# Altium schematic sheet Analog_IOs.SCHDOC: Apalis Evaluation Board 1.1
size A3; Organization: Toradex AG; Address1: Altsagenstrasse 5; Address2: Horw; Address3: 6048; Address4: Switzerland; DocumentNumber: 15; Revision: V1.1; SheetNumber: 15; SheetTotal: 32; PageSetup: Record=PageOptions|CenterHorizontal=True|CenterVertical=True|PrintScale=0.73|XCorrection=1.00|YCorrection=1.00|PrintKind=0|BorderSize=5000000|LeftOffset=0|BottomOffset=0|Orientation=2|PaperLength=1000|PaperWidth=1000|Scale=100|PaperSource=7|PrintQuality=-4|MediaType=1|DitherType=10|PaperKind=A4|PrintScaleMode=1
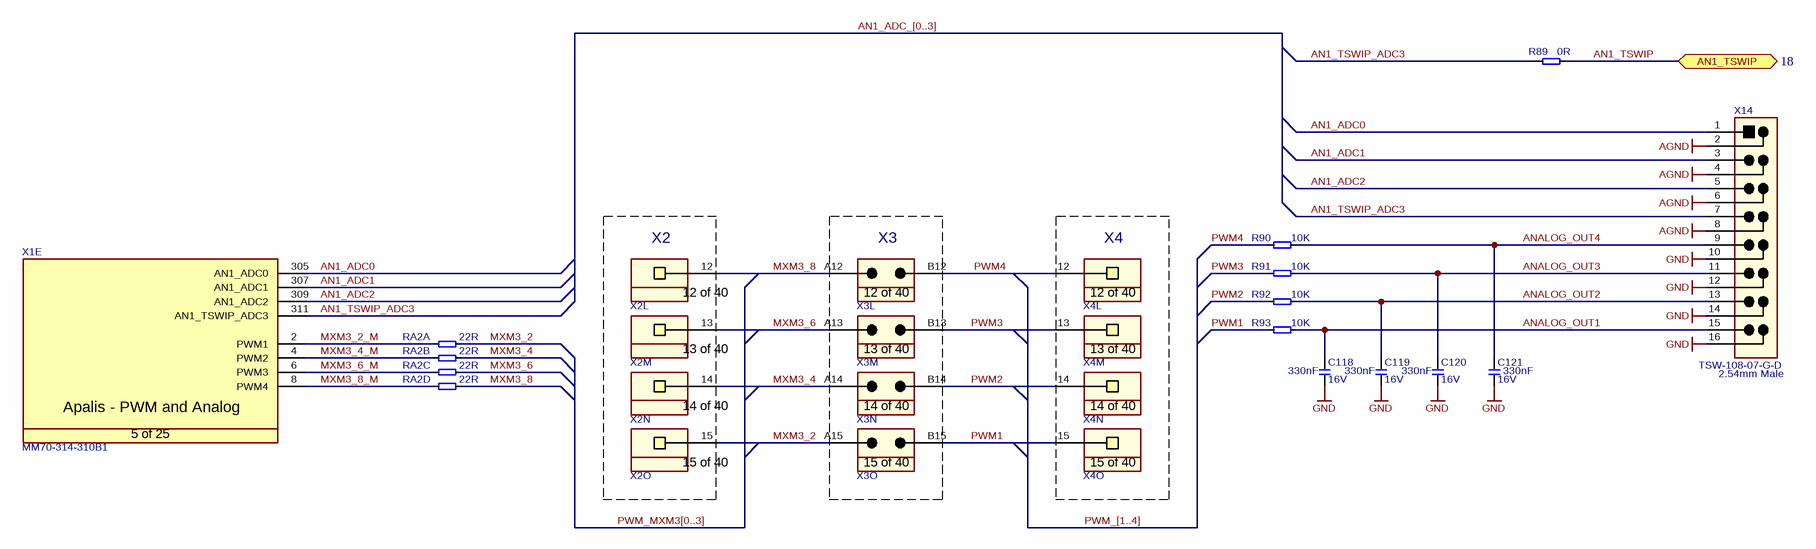
[diagram p0: Analog_IOs.SCHDOC]

## Parts
C118  Rating: 16V  [T_CAPC0805X125N]  (hidden comment: 330nF)
C119  Rating: 16V  [T_CAPC0805X125N]  (hidden comment: 330nF)
C120  Rating: 16V  [T_CAPC0805X125N]  (hidden comment: 330nF)
C121  Rating: 16V  [T_CAPC0805X125N]  (hidden comment: 330nF)
R89  0R  [T_RESC0603X30N]
R90  10K  [T_RESC0603X30N]
R91  10K  [T_RESC0603X30N]
R92  10K  [T_RESC0603X30N]
R93  10K  [T_RESC0603X30N]
RA2  22R  [T_Resistor_Array_X4]  (parts A,B,C,D of 4)
X1  Manufacturer Part No.: MM70-314-310B1  [T_JAE_MM70-314-310B1]  (hidden comment: CON-JAE-MM70-314-310B1-314-0.5mm)  (part E of 25)
X2  SSW-110-01-G-S  [T_Samtec_SSW-110-01-G-S]  (value not drawn)  (parts L,M,N,O of 40)
X3  TSW-110-07-G-D  [T_Samtec_TSW-110-07-G-D]  (value not drawn)  (parts L,M,N,O of 40)
X4  SSW-110-01-G-S  [T_Samtec_SSW-110-01-G-S]  (value not drawn)  (parts L,M,N,O of 40)
X14  TSW-108-07-G-D  [T_Samtec_TSW-108-07-G-D]

## Blocks framed on the sheet
X2: X2
X3: X3
X4: X4

## Ports
AN1_TSWIP (bidir, see 18)

## Nets
AGND: X14.2 X14.4 X14.6 X14.8
GND: C118.1 C119.1 C120.1 C121.1 X14.10 X14.12 X14.14 X14.16
AN1_ADC0: X1.305(AN1_ADC0) X14.1
AN1_ADC1: X1.307(AN1_ADC1) X14.3
AN1_ADC2: X1.309(AN1_ADC2) X14.5
AN1_TSWIP: R89.2 ; port AN1_TSWIP
AN1_TSWIP_ADC3: R89.1 X1.311(AN1_TSWIP_ADC3) X14.7
ANALOG_OUT1: C118.2 R93.2 X14.15
ANALOG_OUT2: C119.2 R92.2 X14.13
ANALOG_OUT3: C120.2 R91.2 X14.11
ANALOG_OUT4: C121.2 R90.2 X14.9
MXM3_2: RA2.1 X2.15 X3.A15
MXM3_2_M: RA2.5 X1.2(PWM1)
MXM3_4: RA2.2 X2.14 X3.A14
MXM3_4_M: RA2.6 X1.4(PWM2)
MXM3_6: RA2.3 X2.13 X3.A13
MXM3_6_M: RA2.7 X1.6(PWM3)
MXM3_8: RA2.4 X2.12 X3.A12
MXM3_8_M: RA2.8 X1.8(PWM4)
PWM1: R93.1 X3.B15 X4.15
PWM2: R92.1 X3.B14 X4.14
PWM3: R91.1 X3.B13 X4.13
PWM4: R90.1 X3.B12 X4.12

## Buses and harness runs
bus AN1_ADC_[0..3]
bus PWM_[1..4]
bus PWM_MXM3[0..3]

## Notes on the sheet
- (near X14) 2.54mm Male
- Title
- Size:
- Date:
- A3
- Number:
- Time:
- Revision:
- Sheet
- of
- File:
- (in symbol CON-JAE-MM70-314-310B1-314-0.5mm, part E) Apalis - PWM and Analog; 5 of 25
- (in symbol CON-Samtec-SSW-110-01-G-S, part L) 12 of 40
- (in symbol CON-Samtec-SSW-110-01-G-S, part M) 13 of 40
- (in symbol CON-Samtec-SSW-110-01-G-S, part N) 14 of 40
- (in symbol CON-Samtec-SSW-110-01-G-S, part O) 15 of 40
- (in symbol CON-Samtec-TSW-110-07-G-D, part L) 12 of 40
- (in symbol CON-Samtec-TSW-110-07-G-D, part M) 13 of 40
- (in symbol CON-Samtec-TSW-110-07-G-D, part N) 14 of 40
- (in symbol CON-Samtec-TSW-110-07-G-D, part O) 15 of 40

## Library data of the parts
C118-C121 = C-X7R-330nF-16V-10%-0805: Capacitor Ceramic X7R 330nF 16V 10% 0805; Tolerance: 10%; Type: X7R; Value: 330nF
R89 = R-0R-63mW-1%-0603: Resistor 0 ohm 63mW 1% 0603; Rating: 63mW; Tolerance: 1%; Value: 0R
R90-R93 = R-10KR-63mW-5%-0603: Resistor 10 Kohm 63mW 5% 0603; Value: 10KR; Rating: 63mW; Tolerance: 5%
RA2 = RA-22R-63mW-5%-1206-div: Resistor Array 22 R 63mW 5% 1206; Tolerance: 5%; Power Dissipation: 63mW; Value: 22R
X1 = CON-JAE-MM70-314-310B1-314-0.5mm: MXM3 Connector; Manufacturer Name: JAE; No. of ways: 314
X2 X4 = CON-Samtec-SSW-110-01-G-S: Receptacle Female Socket 1x40 pin 2.54mm pitch; Manufacturer Name: Samtec; Pitch: 2.54mm; No. of ways: 1x40; Manufacturer Part No.: SSW-110-01-G-S
X3 = CON-Samtec-TSW-110-07-G-D: Header 2x40 pin 2.54mm pitch; Manufacturer Name: Samtec; Pitch: 2.54mm; No. of ways: 2x40; Manufacturer Part No.: TSW-110-07-G-D
X14 = CON-Samtec-TSW-108-07-G-D: Header Male, 2x8 Pins, 2.54mm pitch; Manufacturer Name: Samtec; No. of ways: 2x8; Pitch: 2.54mm; Manufacturer Part No.: TSW-108-07-G-D